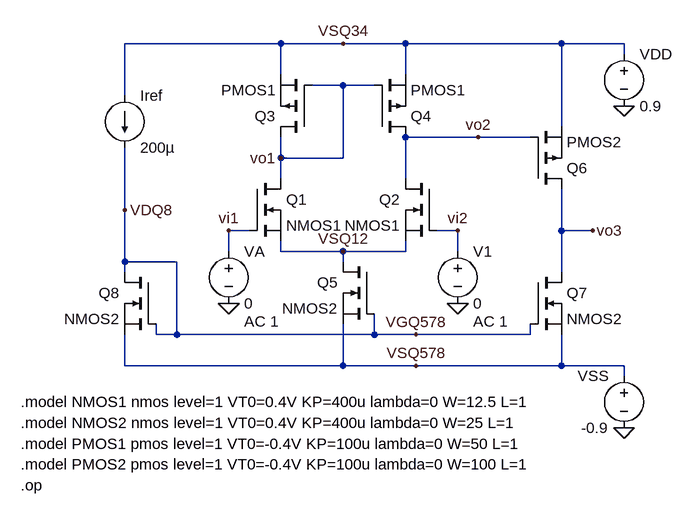
[diagram p0: schematic schema 2.16.asc]
schema 2.16.asc, the LTspice schematic file:
Version 4
SHEET 1 880 680
WIRE 128 -128 -112 -128
WIRE 224 -128 128 -128
WIRE 320 -128 224 -128
WIRE 560 -128 320 -128
WIRE 656 -128 560 -128
WIRE 656 -112 656 -128
WIRE 128 -80 128 -128
WIRE 320 -80 320 -128
WIRE 224 -64 176 -64
WIRE 272 -64 224 -64
WIRE -112 -48 -112 -128
WIRE 560 0 560 -128
WIRE 432 16 320 16
WIRE 512 16 432 16
WIRE 128 48 128 16
WIRE 224 48 224 -64
WIRE 224 48 128 48
WIRE 128 80 128 48
WIRE 320 80 320 16
WIRE -112 128 -112 32
WIRE 80 160 48 160
WIRE 400 160 368 160
WIRE 560 160 560 96
WIRE 608 160 560 160
WIRE 48 192 48 160
WIRE 128 192 128 176
WIRE 224 192 128 192
WIRE 320 192 320 176
WIRE 320 192 224 192
WIRE 400 192 400 160
WIRE -112 208 -112 128
WIRE -32 208 -112 208
WIRE 224 208 224 192
WIRE -112 224 -112 208
WIRE 560 224 560 160
WIRE -64 320 -64 304
WIRE -32 320 -32 208
WIRE -32 320 -64 320
WIRE 272 320 272 288
WIRE 272 320 -32 320
WIRE 336 320 272 320
WIRE 512 320 512 304
WIRE 512 320 336 320
WIRE -112 368 -112 320
WIRE 224 368 224 304
WIRE 224 368 -112 368
WIRE 336 368 224 368
WIRE 560 368 560 320
WIRE 560 368 336 368
WIRE 656 368 560 368
WIRE 656 384 656 368
FLAG 656 -32 0
FLAG 656 464 0
FLAG 48 272 0
FLAG 400 272 0
FLAG -112 128 VDQ8
FLAG 224 192 VSQ12
FLAG 336 368 VSQ578
FLAG 608 160 vo3
FLAG 128 48 vo1
FLAG 432 16 vo2
FLAG 224 -128 VSQ34
FLAG 48 160 vi1
FLAG 400 160 vi2
FLAG 336 320 VGQ578
SYMBOL nmos -64 224 M0
SYMATTR InstName Q8
SYMATTR Value NMOS2
SYMBOL nmos 272 208 M0
SYMATTR InstName Q5
SYMATTR Value NMOS2
SYMBOL nmos 512 224 R0
SYMATTR InstName Q7
SYMATTR Value NMOS2
SYMBOL voltage 656 -128 R0
SYMATTR InstName VDD
SYMATTR Value 0.9
SYMBOL voltage 656 368 M0
SYMATTR InstName VSS
SYMATTR Value -0.9
SYMBOL nmos 80 80 R0
SYMATTR InstName Q1
SYMATTR Value NMOS1
SYMBOL voltage 48 176 R0
WINDOW 123 24 124 Left 2
WINDOW 39 0 0 Left 0
SYMATTR Value2 AC 1
SYMATTR InstName VA
SYMATTR Value 0
SYMBOL nmos 368 80 M0
SYMATTR InstName Q2
SYMATTR Value NMOS1
SYMBOL pmos 176 16 R180
SYMATTR InstName Q3
SYMATTR Value PMOS1
SYMBOL pmos 272 16 M180
SYMATTR InstName Q4
SYMATTR Value PMOS1
SYMBOL current -112 -48 R0
SYMATTR InstName Iref
SYMATTR Value 200µ
SYMBOL pmos 512 96 M180
SYMATTR InstName Q6
SYMATTR Value PMOS2
SYMBOL voltage 400 176 R0
WINDOW 123 24 124 Left 2
WINDOW 39 0 0 Left 0
SYMATTR Value2 AC 1
SYMATTR InstName V1
SYMATTR Value 0
TEXT -272 424 Left 2 !.model NMOS1 nmos level=1 VT0=0.4V KP=400u lambda=0 W=12.5 L=1
TEXT -272 456 Left 2 !.model NMOS2 nmos level=1 VT0=0.4V KP=400u lambda=0 W=25 L=1
TEXT -272 488 Left 2 !.model PMOS1 pmos level=1 VT0=-0.4V KP=100u lambda=0 W=50 L=1
TEXT -272 520 Left 2 !.model PMOS2 pmos level=1 VT0=-0.4V KP=100u lambda=0 W=100 L=1
TEXT -272 552 Left 2 !.op

The netlist it stands for:
* schema 2.16.asc
M§Q8 VGQ578 VGQ578 VSQ578 VSQ578 NMOS2
M§Q5 VSQ12 VGQ578 VSQ578 VSQ578 NMOS2
M§Q7 vo3 VGQ578 VSQ578 VSQ578 NMOS2
VDD VSQ34 0 0.9
VSS VSQ578 0 -0.9
M§Q1 vo1 vi1 VSQ12 VSQ12 NMOS1
VA vi1 0 0 AC 1
M§Q2 vo2 vi2 VSQ12 VSQ12 NMOS1
M§Q3 vo1 vo1 VSQ34 VSQ34 PMOS1
M§Q4 vo2 vo1 VSQ34 VSQ34 PMOS1
Iref VSQ34 VGQ578 200µ
M§Q6 vo3 vo2 VSQ34 VSQ34 PMOS2
V1 vi2 0 0 AC 1
.model NMOS NMOS
.model PMOS PMOS
.lib standard.mos
.model NMOS1 nmos level=1 VT0=0.4V KP=400u lambda=0 W=12.5 L=1
.model NMOS2 nmos level=1 VT0=0.4V KP=400u lambda=0 W=25 L=1
.model PMOS1 pmos level=1 VT0=-0.4V KP=100u lambda=0 W=50 L=1
.model PMOS2 pmos level=1 VT0=-0.4V KP=100u lambda=0 W=100 L=1
.op
.backanno
.end

* Results of the author's LTspice run, read from the files saved beside the schematic
* Operating Point:
*   V(vgq578) = -300 mV
*   V(vsq578) = -900 mV
*   V(vsq12) = -600 mV
*   V(vo3) = -700.6 mV
*   V(vsq34) = 900 mV
*   V(vo1) = 300 mV
*   V(vi1) = 0 V
*   V(vo2) = 300 mV
*   V(vi2) = 0 V
*   Id(Q6) = -200 µA
*   Ig(Q6) = 0 A
*   Ib(Q6) = 1.611 pA
*   Is(Q6) = 200 µA
*   Id(Q4) = -100 µA
*   Ig(Q4) = 0 A
*   Ib(Q4) = 610 fA
*   Is(Q4) = 100 µA
*   Id(Q3) = -100 µA
*   Ig(Q3) = 0 A
*   Ib(Q3) = 610 fA
*   Is(Q3) = 100 µA
*   Id(Q2) = 100 µA
*   Ig(Q2) = 0 A
*   Ib(Q2) = -910 fA
*   Is(Q2) = -100 µA
*   Id(Q1) = 100 µA
*   Ig(Q1) = 0 A
*   Ib(Q1) = -910 fA
*   Is(Q1) = -100 µA
*   Id(Q7) = 200 µA
*   Ig(Q7) = 0 A
*   Ib(Q7) = -209.4 fA
*   Is(Q7) = -200 µA
*   Id(Q5) = 200 µA
*   Ig(Q5) = 0 A
*   Ib(Q5) = -310 fA
*   Is(Q5) = -200 µA
*   Id(Q8) = 200 µA
*   Ig(Q8) = 0 A
*   Ib(Q8) = -610 fA
*   Is(Q8) = -200 µA
*   I(Iref) = 200 µA
*   I(V1) = 0 A
*   I(Va) = 0 A
*   I(Vss) = 600 µA
*   I(Vdd) = -600 µA
* From the log:
*   Semiconductor Device Operating Points:
*                           --- MOSFET Transistors ---
*   Name:         m§q6        m§q4        m§q3        m§q2        m§q1
*   Model:        pmos2       pmos1       pmos1       nmos1       nmos1
*   Id:         -2.00e-04   -1.00e-04   -1.00e-04    1.00e-04    1.00e-04
*   Vgs:        -6.00e-01   -6.00e-01   -6.00e-01    6.00e-01    6.00e-01
*   Vds:        -1.60e+00   -6.00e-01   -6.00e-01    9.00e-01    9.00e-01
*   Vbs:         0.00e+00    0.00e+00    0.00e+00    0.00e+00    0.00e+00
*   Vth:        -4.00e-01   -4.00e-01   -4.00e-01    4.00e-01    4.00e-01
*   Vdsat:      -2.00e-01   -2.00e-01   -2.00e-01    2.00e-01    2.00e-01
*   Gm:          2.00e-03    1.00e-03    1.00e-03    1.00e-03    1.00e-03
*   Gds:         0.00e+00    0.00e+00    0.00e+00    0.00e+00    0.00e+00
*   Gmb:         0.00e+00    0.00e+00    0.00e+00    0.00e+00    0.00e+00
*   Cbd:         0.00e+00    0.00e+00    0.00e+00    0.00e+00    0.00e+00
*   Cbs:         0.00e+00    0.00e+00    0.00e+00    0.00e+00    0.00e+00
*   Cgsov:       0.00e+00    0.00e+00    0.00e+00    0.00e+00    0.00e+00
*   Cgdov:       0.00e+00    0.00e+00    0.00e+00    0.00e+00    0.00e+00
*   Cgbov:       0.00e+00    0.00e+00    0.00e+00    0.00e+00    0.00e+00
*   Cgs:         0.00e+00    0.00e+00    0.00e+00    0.00e+00    0.00e+00
*   Cgd:         0.00e+00    0.00e+00    0.00e+00    0.00e+00    0.00e+00
*   Cgb:         0.00e+00    0.00e+00    0.00e+00    0.00e+00    0.00e+00
*   Name:         m§q7        m§q5        m§q8
*   Model:        nmos2       nmos2       nmos2
*   Id:          2.00e-04    2.00e-04    2.00e-04
*   Vgs:         6.00e-01    6.00e-01    6.00e-01
*   Vds:         1.99e-01    3.00e-01    6.00e-01
*   Vbs:         0.00e+00    0.00e+00    0.00e+00
*   Vth:         4.00e-01    4.00e-01    4.00e-01
*   Vdsat:       2.00e-01    2.00e-01    2.00e-01
*   Gm:          1.99e-03    2.00e-03    2.00e-03
*   Gds:         5.59e-06    0.00e+00    0.00e+00
*   Gmb:         0.00e+00    0.00e+00    0.00e+00
*   Cbd:         0.00e+00    0.00e+00    0.00e+00
*   Cbs:         0.00e+00    0.00e+00    0.00e+00
*   Cgsov:       0.00e+00    0.00e+00    0.00e+00
*   Cgdov:       0.00e+00    0.00e+00    0.00e+00
*   Cgbov:       0.00e+00    0.00e+00    0.00e+00
*   Cgs:         0.00e+00    0.00e+00    0.00e+00
*   Cgd:         0.00e+00    0.00e+00    0.00e+00
*   Cgb:         0.00e+00    0.00e+00    0.00e+00